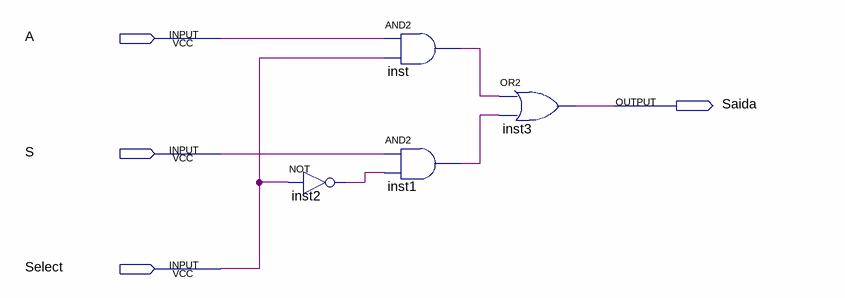
[diagram p0: schematic sheet]
// Quartus schematic multiplex.bdf as structural Verilog: 4 symbols, 4 pins
module multiplex (
  input  A,
  input  S,
  input  Select,
  output Saida
);

  wire inst1_out, inst2_out, inst_out;

  not inst2 (inst2_out, Select);
  and inst (inst_out, A, Select);
  and inst1 (inst1_out, S, inst2_out);
  or inst3 (Saida, inst_out, inst1_out);
endmodule
